# EAGLE design mano_rev_1_1 (EAGLE 9.2.2)
DATE: 2019.05.04; REV: 1.1
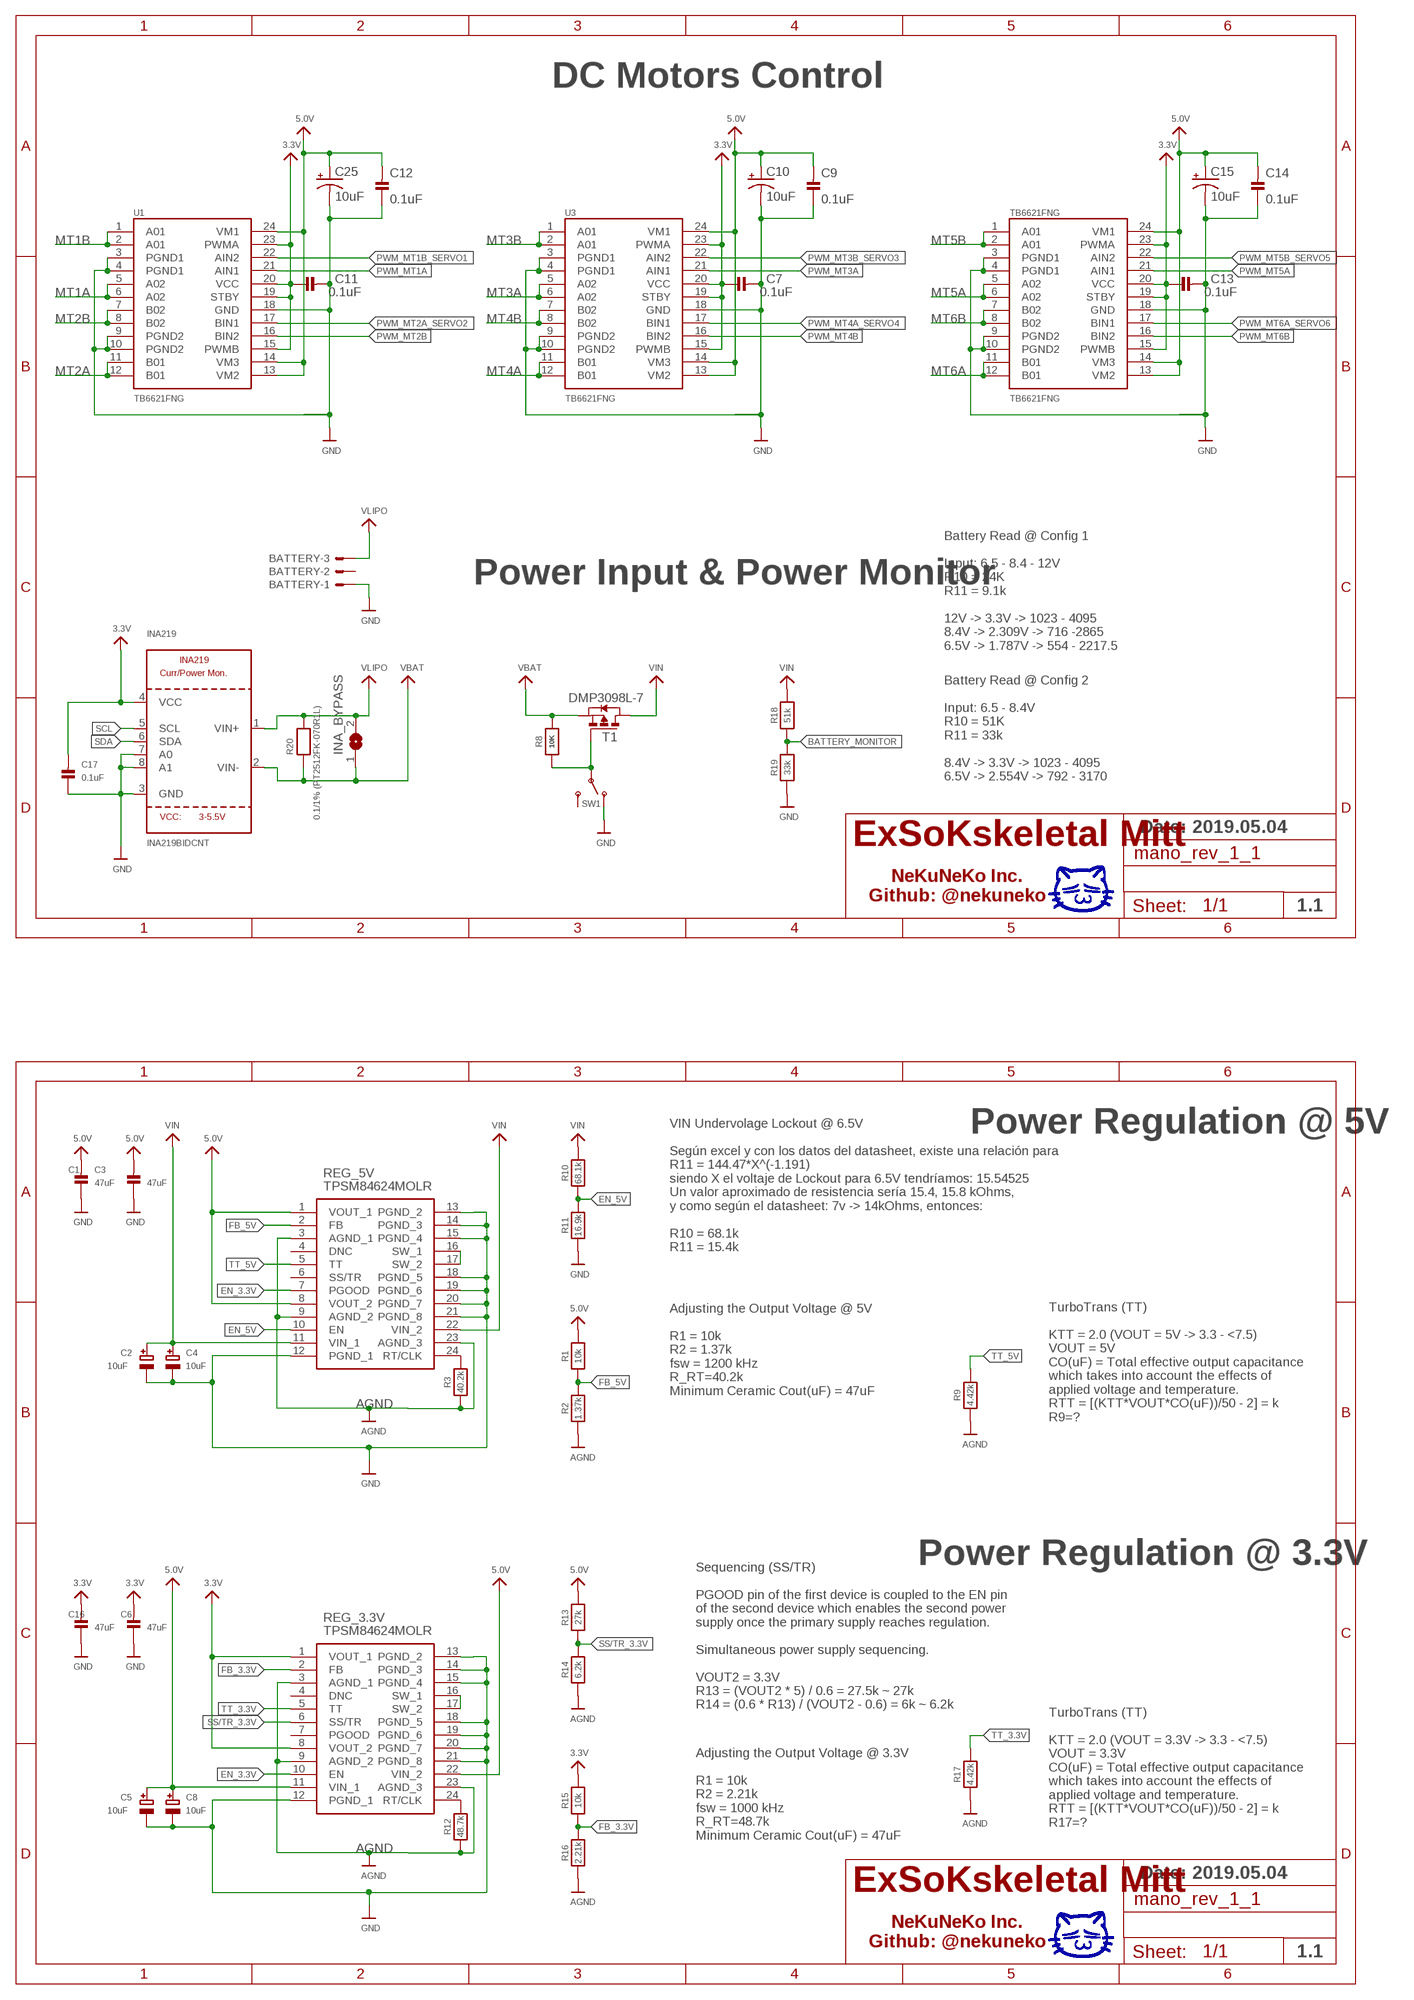
[diagram p0: schematic, sheet 1, part 1 of 2]
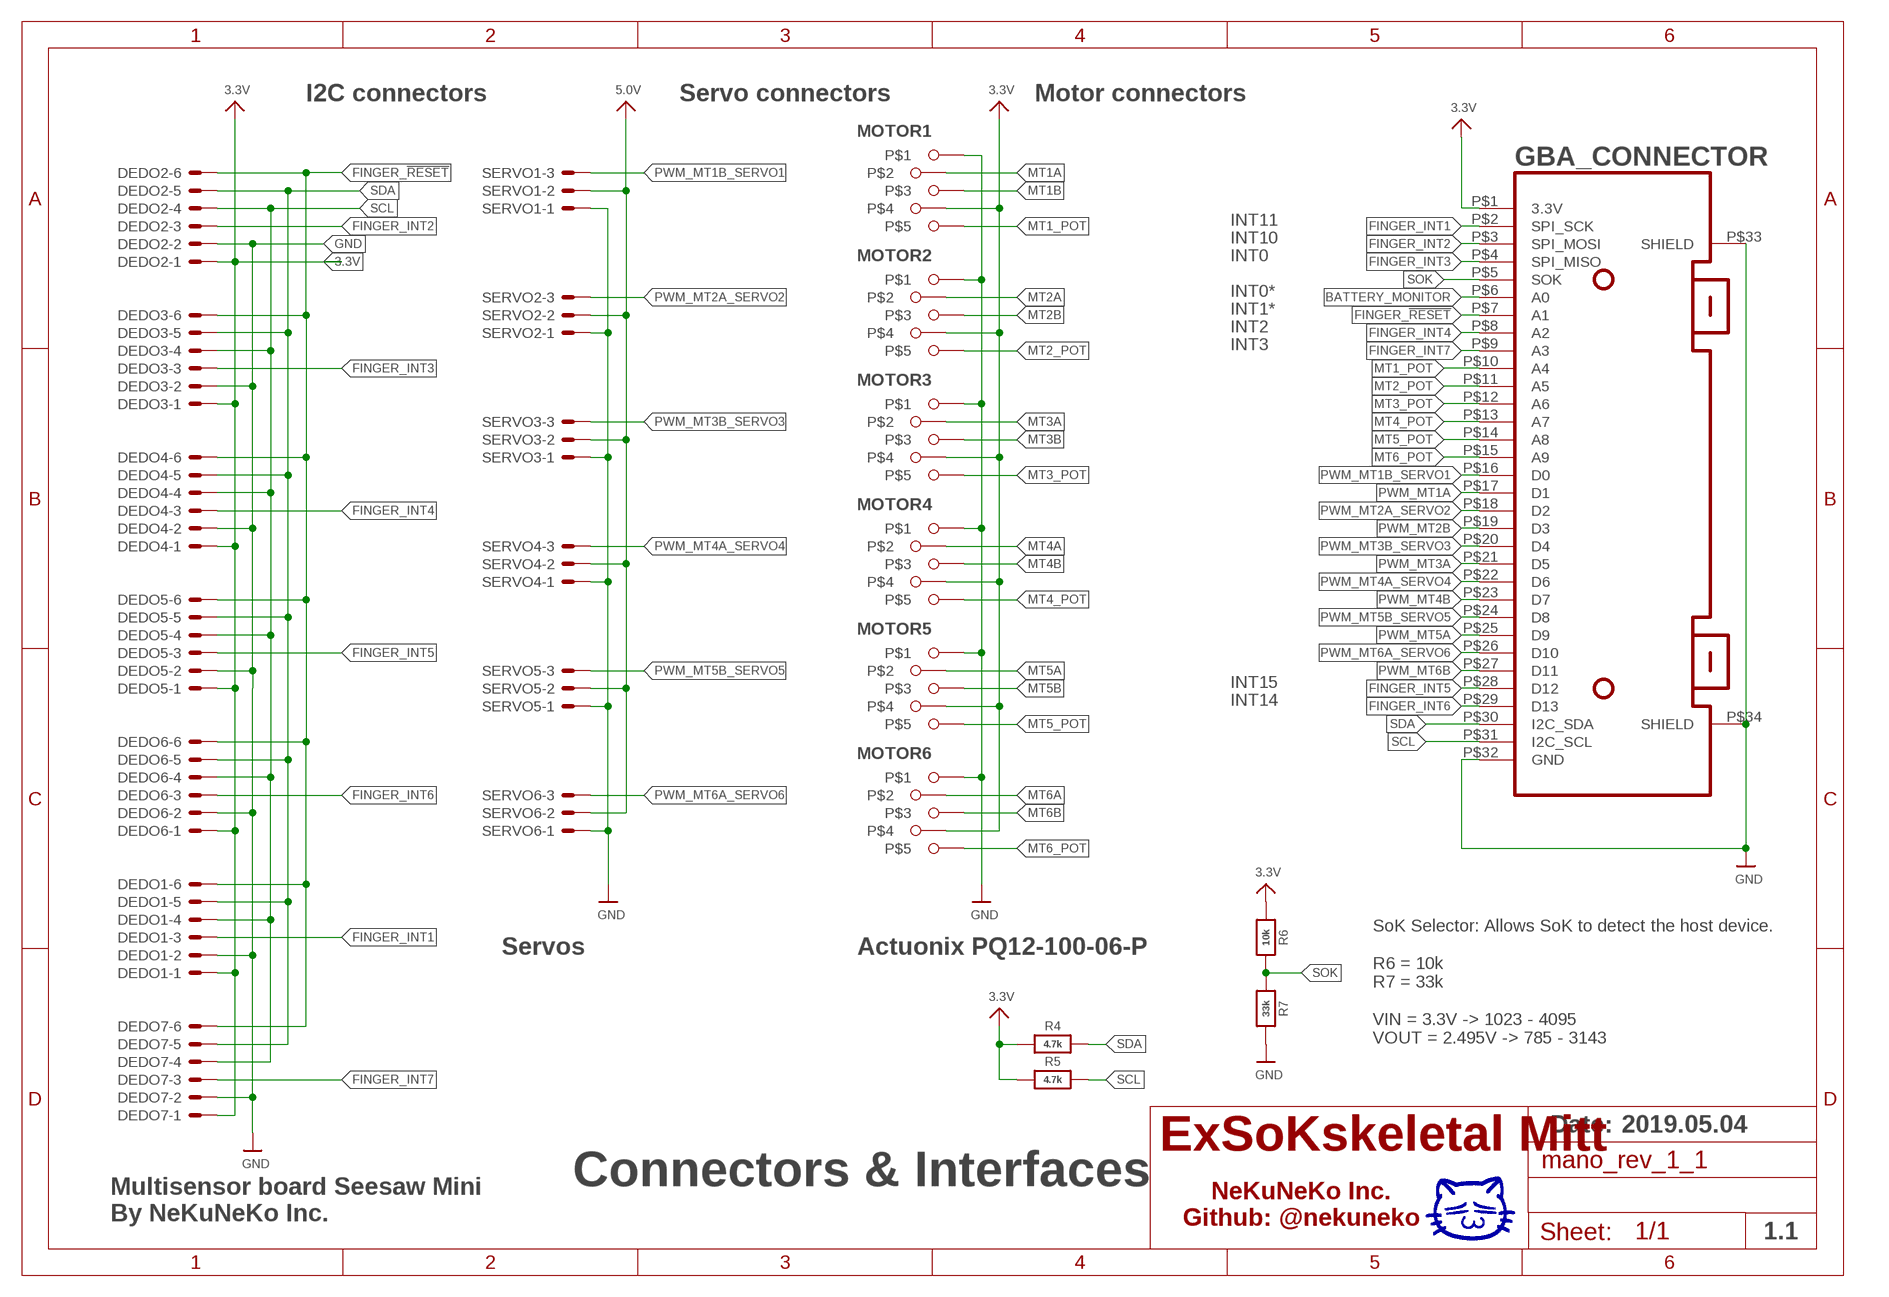
[diagram p1: schematic, sheet 1, part 2 of 2]

## Parts
BATTERY  JST-XH-03-PIN-LONG-PAD  [JST-XH-03-PACKAGE-LONG-PAD]
C1  47uF  CAP_CERAMIC_0603  [_0603]
C2  10uF  CAP_TANTALUMA/3216_REFLOW  [EIA3216-18/A-R]
C3  47uF  CAP_CERAMIC_0603  [_0603]
C4  10uF  CAP_TANTALUMA/3216_REFLOW  [EIA3216-18/A-R]
C5  10uF  CAP_TANTALUMA/3216_REFLOW  [EIA3216-18/A-R]
C6  47uF  CAP_CERAMIC_0603  [_0603]
C7  0.1uF  CAP_CERAMIC_0603  [_0603]
C8  10uF  CAP_TANTALUMA/3216_REFLOW  [EIA3216-18/A-R]
C9  0.1uF  CAP_CERAMIC_0603  [_0603]
C10  10uF  10UF-POLAR-0603-6.3V-20%(TANT)  [0603-POLAR]
C11  0.1uF  CAP_CERAMIC_0603  [_0603]
C12  0.1uF  CAP_CERAMIC_0603  [_0603]
C13  0.1uF  CAP_CERAMIC_0603  [_0603]
C14  0.1uF  CAP_CERAMIC_0603  [_0603]
C15  10uF  10UF-POLAR-0603-6.3V-20%(TANT)  [0603-POLAR]
C16  47uF  CAP_CERAMIC_0603  [_0603]
C17  0.1uF  CAP_CERAMIC_0603  [_0603]
C25  10uF  10UF-POLAR-0603-6.3V-20%(TANT)  [0603-POLAR]
DEDO1  FINGER_1  BM06B-SRSS-TB  [BM06B-SRSS-TB]
DEDO2  FINGER_2  BM06B-SRSS-TB  [BM06B-SRSS-TB]
DEDO3  FINGER_3  BM06B-SRSS-TB  [BM06B-SRSS-TB]
DEDO4  FINGER_4  BM06B-SRSS-TB  [BM06B-SRSS-TB]
DEDO5  FINGER_5  BM06B-SRSS-TB  [BM06B-SRSS-TB]
DEDO6  FINGER_6  BM06B-SRSS-TB  [BM06B-SRSS-TB]
DEDO7  FINGER_7  BM06B-SRSS-TB  [BM06B-SRSS-TB]
GBA_CONNECTOR  GBA_CARTRIDGE  [GBA_CARTRIDGE]
INA219  INA219BIDCNT  INA219  [SOT23-8]
INA_BYPASS  SOLDERJUMPERREFLOW_NOPASTE  [SOLDERJUMPER_REFLOW_NOPASTE]
MOTOR1  Actuonix PQ12-100-06-P  5PIN  [5PIN]
MOTOR2  Actuonix PQ12-100-06-P  5PIN  [5PIN]
MOTOR3  Actuonix PQ12-100-06-P  5PIN  [5PIN]
MOTOR4  Actuonix PQ12-100-06-P  5PIN  [5PIN]
MOTOR5  Actuonix PQ12-100-06-P  5PIN  [5PIN]
MOTOR6  Actuonix PQ12-100-06-P  5PIN  [5PIN]
R1  10k  RESISTOR_0603  [_0603]
R2  1.37k  RESISTOR_0603  [_0603]
R3  40.2k  RESISTOR_0603  [_0603]
R4  4.7k  RESISTOR_0603  [_0603]
R5  4.7k  RESISTOR_0603  [_0603]
R6  10k  RESISTOR_0603  [_0603]
R7  33k  RESISTOR_0603  [_0603]
R8  10K  RESISTOR_0805  [_0805]
R9  4.42k  RESISTOR_0603  [_0603]
R10  68.1k  RESISTOR_0603  [_0603]
R11  16.9k  RESISTOR_0603  [_0603]
R12  48.7k  RESISTOR_0603  [_0603]
R13  27k  RESISTOR_0603  [_0603]
R14  6.2k  RESISTOR_0603  [_0603]
R15  10k  RESISTOR_0603  [_0603]
R16  2.21k  RESISTOR_0603  [_0603]
R17  4.42k  RESISTOR_0603  [_0603]
R18  51k  RESISTOR_0603  [_0603]
R19  33k  RESISTOR_0603  [_0603]
R20  0.1/1% (PT2512FK-070R1L)  RESISTOR2512  [2512]
REG_3.3V  TPSM84624MOLR  [TPSM84624MOLR]
REG_5V  TPSM84624MOLR  [TPSM84624MOLR]
SERVO1  JST-XH-03-PIN-LONG-PAD  [JST-XH-03-PACKAGE-LONG-PAD]
SERVO2  JST-XH-03-PIN-LONG-PAD  [JST-XH-03-PACKAGE-LONG-PAD]
SERVO3  JST-XH-03-PIN-LONG-PAD  [JST-XH-03-PACKAGE-LONG-PAD]
SERVO4  JST-XH-03-PIN-LONG-PAD  [JST-XH-03-PACKAGE-LONG-PAD]
SERVO5  JST-XH-03-PIN-LONG-PAD  [JST-XH-03-PACKAGE-LONG-PAD]
SERVO6  JST-XH-03-PIN-LONG-PAD  [JST-XH-03-PACKAGE-LONG-PAD]
SW1  SWITCH_SPDT  [SPDT_SMT_SSSS811101]
T1  DMP3098L-7  PMOSSOT23  [SOT-23]
TB6621FNG  TB6621FNG  [SSOP24]
U1  TB6621FNG  [SSOP24]
U3  TB6621FNG  [SSOP24]

## Nets
3.3V: C6.2 C7.1 C11.1 C13.1 C16.2 C17.2 DEDO1.1 DEDO2.1 DEDO3.1 DEDO4.1 DEDO5.1 DEDO6.1 DEDO7.1 GBA_CONNECTOR.P$1(3.3V) INA219.4(VCC) MOTOR1.4 MOTOR2.4 MOTOR3.4 MOTOR4.4 MOTOR5.4 MOTOR6.4 R4.1 R5.1 R6.1 R15.2 REG_3.3V.1(VOUT_1) REG_3.3V.8(VOUT_2) TB6621FNG.15(PWMB) TB6621FNG.19(STBY) TB6621FNG.20(VCC) TB6621FNG.23(PWMA) U1.15(PWMB) U1.19(STBY) U1.20(VCC) U1.23(PWMA) U3.15(PWMB) U3.19(STBY) U3.20(VCC) U3.23(PWMA)
5.0V: C1.2 C3.2 C5.+ C8.+ C9.2 C10.+ C12.2 C14.2 C15.+ C25.+ R1.2 R13.2 REG_3.3V.11(VIN_1) REG_3.3V.22(VIN_2) REG_5V.1(VOUT_1) REG_5V.8(VOUT_2) SERVO1.2 SERVO2.2 SERVO3.2 SERVO4.2 SERVO5.2 SERVO6.2 TB6621FNG.13(VM2) TB6621FNG.14(VM3) TB6621FNG.24(VM1) U1.13(VM2) U1.14(VM3) U1.24(VM1) U3.13(VM2) U3.14(VM3) U3.24(VM1)
AGND: R2.1 R3.1 R9.1 R12.1 R14.1 R16.1 R17.1 REG_3.3V.3(AGND_1) REG_3.3V.9(AGND_2) REG_3.3V.23(AGND_3) REG_5V.3(AGND_1) REG_5V.9(AGND_2) REG_5V.23(AGND_3)
BATTERY_MONITOR: GBA_CONNECTOR.P$6(A0) R18.1 R19.2
EN_3.3V: REG_3.3V.10(EN) REG_5V.7(PGOOD)
EN_5V: R10.1 R11.2 REG_5V.10(EN)
FB_3.3V: R15.1 R16.2 REG_3.3V.2(FB)
FB_5V: R1.1 R2.2 REG_5V.2(FB)
FINGER_!RESET: DEDO1.6 DEDO2.6 DEDO3.6 DEDO4.6 DEDO5.6 DEDO6.6 DEDO7.6 GBA_CONNECTOR.P$7(A1)
FINGER_INT1: DEDO1.3 GBA_CONNECTOR.P$2(SPI_SCK)
FINGER_INT2: DEDO2.3 GBA_CONNECTOR.P$3(SPI_MOSI)
FINGER_INT3: DEDO3.3 GBA_CONNECTOR.P$4(SPI_MISO)
FINGER_INT4: DEDO4.3 GBA_CONNECTOR.P$8(A2)
FINGER_INT5: DEDO5.3 GBA_CONNECTOR.P$28(D12)
FINGER_INT6: DEDO6.3 GBA_CONNECTOR.P$29(D13)
FINGER_INT7: DEDO7.3 GBA_CONNECTOR.P$9(A3)
GND [gnd]: BATTERY.1 C1.1 C2.- C3.1 C4.- C5.- C6.1 C7.2 C8.- C9.1 C10.- C11.2 C12.1 C13.2 C14.1 C15.- C16.1 C17.1 C25.- DEDO1.2 DEDO2.2 DEDO3.2 DEDO4.2 DEDO5.2 DEDO6.2 DEDO7.2 GBA_CONNECTOR.P$32(GND) GBA_CONNECTOR.P$33(SHIELD) GBA_CONNECTOR.P$34(SHIELD) INA219.3(GND) INA219.7(A0) INA219.8(A1) MOTOR1.1 MOTOR2.1 MOTOR3.1 MOTOR4.1 MOTOR5.1 MOTOR6.1 R7.2 R11.1 R19.1 REG_3.3V.12(PGND_1) REG_3.3V.13(PGND_2) REG_3.3V.14(PGND_3) REG_3.3V.15(PGND_4) REG_3.3V.18(PGND_5) REG_3.3V.19(PGND_6) REG_3.3V.20(PGND_7) REG_3.3V.21(PGND_8) REG_5V.12(PGND_1) REG_5V.13(PGND_2) REG_5V.14(PGND_3) REG_5V.15(PGND_4) REG_5V.18(PGND_5) REG_5V.19(PGND_6) REG_5V.20(PGND_7) REG_5V.21(PGND_8) SERVO1.1 SERVO2.1 SERVO3.1 SERVO4.1 SERVO5.1 SERVO6.1 SW1.A(O) TB6621FNG.3(PGND1) TB6621FNG.4(PGND1) TB6621FNG.9(PGND2) TB6621FNG.10(PGND2) TB6621FNG.18(GND) U1.3(PGND1) U1.4(PGND1) U1.9(PGND2) U1.10(PGND2) U1.18(GND) U3.3(PGND1) U3.4(PGND1) U3.9(PGND2) U3.10(PGND2) U3.18(GND)
MT1_POT: GBA_CONNECTOR.P$10(A4) MOTOR1.5
MT1A: MOTOR1.2 U1.5(A02) U1.6(A02)
MT1B: MOTOR1.3 U1.1(A01) U1.2(A01)
MT2_POT: GBA_CONNECTOR.P$11(A5) MOTOR2.5
MT2A: MOTOR2.2 U1.11(B01) U1.12(B01)
MT2B: MOTOR2.3 U1.7(B02) U1.8(B02)
MT3_POT: GBA_CONNECTOR.P$12(A6) MOTOR3.5
MT3A: MOTOR3.2 U3.5(A02) U3.6(A02)
MT3B: MOTOR3.3 U3.1(A01) U3.2(A01)
MT4_POT: GBA_CONNECTOR.P$13(A7) MOTOR4.5
MT4A: MOTOR4.2 U3.11(B01) U3.12(B01)
MT4B: MOTOR4.3 U3.7(B02) U3.8(B02)
MT5_POT: GBA_CONNECTOR.P$14(A8) MOTOR5.5
MT5A: MOTOR5.2 TB6621FNG.5(A02) TB6621FNG.6(A02)
MT5B: MOTOR5.3 TB6621FNG.1(A01) TB6621FNG.2(A01)
MT6_POT: GBA_CONNECTOR.P$15(A9) MOTOR6.5
MT6A: MOTOR6.2 TB6621FNG.11(B01) TB6621FNG.12(B01)
MT6B: MOTOR6.3 TB6621FNG.7(B02) TB6621FNG.8(B02)
N$1: R8.1 SW1.B(P) T1.3(G)
N$2: REG_5V.16(SW_1) REG_5V.17(SW_2)
N$3: R12.2 REG_3.3V.24(RT/CLK)
N$4: REG_3.3V.16(SW_1) REG_3.3V.17(SW_2)
N$6: R3.2 REG_5V.24(RT/CLK)
PWM_MT1A: GBA_CONNECTOR.P$17(D1) U1.21(AIN1)
PWM_MT1B_SERVO1: GBA_CONNECTOR.P$16(D0) SERVO1.3 U1.22(AIN2)
PWM_MT2A_SERVO2: GBA_CONNECTOR.P$18(D2) SERVO2.3 U1.17(BIN1)
PWM_MT2B: GBA_CONNECTOR.P$19(D3) U1.16(BIN2)
PWM_MT3A: GBA_CONNECTOR.P$21(D5) U3.21(AIN1)
PWM_MT3B_SERVO3: GBA_CONNECTOR.P$20(D4) SERVO3.3 U3.22(AIN2)
PWM_MT4A_SERVO4: GBA_CONNECTOR.P$22(D6) SERVO4.3 U3.17(BIN1)
PWM_MT4B: GBA_CONNECTOR.P$23(D7) U3.16(BIN2)
PWM_MT5A: GBA_CONNECTOR.P$25(D9) TB6621FNG.21(AIN1)
PWM_MT5B_SERVO5: GBA_CONNECTOR.P$24(D8) SERVO5.3 TB6621FNG.22(AIN2)
PWM_MT6A_SERVO6: GBA_CONNECTOR.P$26(D10) SERVO6.3 TB6621FNG.17(BIN1)
PWM_MT6B: GBA_CONNECTOR.P$27(D11) TB6621FNG.16(BIN2)
SCL: DEDO1.4 DEDO2.4 DEDO3.4 DEDO4.4 DEDO5.4 DEDO6.4 DEDO7.4 GBA_CONNECTOR.P$31(I2C_SCL) INA219.5(SCL) R5.2
SDA: DEDO1.5 DEDO2.5 DEDO3.5 DEDO4.5 DEDO5.5 DEDO6.5 DEDO7.5 GBA_CONNECTOR.P$30(I2C_SDA) INA219.6(SDA) R4.2
SOK: GBA_CONNECTOR.P$5(SOK) R6.2 R7.1
SS/TR_3.3V: R13.1 R14.2 REG_3.3V.6(SS/TR)
TT_3.3V: R17.2 REG_3.3V.5(TT)
TT_5V: R9.2 REG_5V.5(TT)
VBAT: INA219.2(VIN-) INA_BYPASS.1 R8.2 R20.1 T1.2(S)
VIN: C2.+ C4.+ R10.2 R18.2 REG_5V.11(VIN_1) REG_5V.22(VIN_2) T1.1(D)
VLIPO: BATTERY.3 INA219.1(VIN+) INA_BYPASS.2 R20.2
Unconnected: BATTERY.2 REG_3.3V.4(DNC) REG_3.3V.7(PGOOD) REG_5V.4(DNC) REG_5V.6(SS/TR) SW1.C(S)

## Notes on the sheet
- I2C connectors | Servo connectors | Motor connectors
- DC Motors Control
- INT11
- INT10
- INT0
- INT0*
- INT1*
- INT2
- INT3
- INT15
- INT14
- Power Input & Power Monitor
- Battery Read @ Config 1
  
  Input: 6.5 - 8.4 - 12V
  R10 = 24K
  R11 = 9.1k
  
  12V -> 3.3V -> 1023 - 4095
  8.4V -> 2.309V -> 716 -2865
  6.5V -> 1.787V -> 554 - 2217.5
- Servos | Actuonix PQ12-100-06-P
- SoK Selector: Allows SoK to detect the host device.
  
  R6 = 10k
  R7 = 33k 
  
  VIN = 3.3V -> 1023 - 4095
  VOUT = 2.495V -> 785 - 3143
- Battery Read @ Config 2
  
  Input: 6.5 - 8.4V
  R10 = 51K
  R11 = 33k
  
  8.4V -> 3.3V -> 1023 - 4095
  6.5V -> 2.554V -> 792 - 3170
- Date: | Date:
- ExSoKskeletal Mitt | ExSoKskeletal Mitt
- Connectors & Interfaces
- NeKuNeKo Inc.
  Github: @nekuneko
- NeKuNeKo Inc.
  Github: @nekuneko
- Multisensor board Seesaw Mini
  By NeKuNeKo Inc.
- Power Regulation @ 5V
- VIN Undervolage Lockout @ 6.5V
  
  Según excel y con los datos del datasheet, existe una relación para 
  R11 = 144.47*X^(-1.191)
  siendo X el voltaje de Lockout para 6.5V tendríamos: 15.54525
  Un valor aproximado de resistencia sería 15.4, 15.8 kOhms, 
  y como según el datasheet: 7v -> 14kOhms, entonces:
  
  R10 = 68.1k
  R11 = 15.4k
- Adjusting the Output Voltage @ 5V
  
  R1 = 10k
  R2 = 1.37k
  fsw = 1200 kHz
  R_RT=40.2k
  Minimum Ceramic Cout(uF) = 47uF
- TurboTrans (TT)
  
  KTT = 2.0 (VOUT = 5V -> 3.3 - <7.5)
  VOUT = 5V
  CO(uF) = Total effective output capacitance
  which takes into account the effects of
  applied voltage and temperature.
  RTT = [(KTT*VOUT*CO(uF))/50 - 2] = k
  R9=?
- Power Regulation @ 3.3V
- Sequencing (SS/TR)
  
  PGOOD pin of the first device is coupled to the EN pin 
  of the second device which enables the second power 
  supply once the primary supply reaches regulation.
  
  Simultaneous power supply sequencing.
  
  VOUT2 = 3.3V
  R13 = (VOUT2 * 5) / 0.6 = 27.5k ~ 27k
  R14 = (0.6 * R13) / (VOUT2 - 0.6) = 6k ~ 6.2k
- TurboTrans (TT)
  
  KTT = 2.0 (VOUT = 3.3V -> 3.3 - <7.5)
  VOUT = 3.3V
  CO(uF) = Total effective output capacitance
  which takes into account the effects of
  applied voltage and temperature.
  RTT = [(KTT*VOUT*CO(uF))/50 - 2] = k
  R17=?
- Adjusting the Output Voltage @ 3.3V
  
  R1 = 10k
  R2 = 2.21k
  fsw = 1000 kHz
  R_RT=48.7k
  Minimum Ceramic Cout(uF) = 47uF
- Date:
- ExSoKskeletal Mitt
- NeKuNeKo Inc.
  Github: @nekuneko

## Library data of the parts
BATTERY SERVO1-SERVO6 = JST XH Connectors v1-0:JST-XH-03-PIN: JST XH Connector 2 Pin Wire to board connector. Pitch: 2,54 mm, (0.100") Number of pins: 3 Created by Rembrandt Electronics www.rembrandtelectronics.com
C1 C3 C6 C7 C9 C11-C14 C16 C17 = microbuilder:CAP_CERAMIC: Ceramic Capacitors 0402 - 0402 Surface Mount Capacitors 16pF 50V 5% [Digikey: 445-4899-2-ND] 18pF 50V 5% [Digikey: 490-1281-2-ND] 22pF 50V 5% [Digikey: 490-1283-2-ND] 68pF 50V 5% [Digikey: 490-1289-2-ND] 0.1uF 10V 10% [Digikey: 490-1318-2-ND] 1.0uF 6.3V 10% [Digikey: 490-1320-2-ND] 0603 - 0603 Surface Mount Capacitors 16 pF 50V 5% [Digikey: 445-5051-2-ND] 22 pF 50V [Digikey: PCC220ACVTR-ND] 33 pF 50V 5% [Digikey: 490-1415-1-ND] 56pF 50V 5% [Digikey: 490-1421-1-ND] 220pF 50V 5% [Digikey: 445-1285-1-ND] 680 pF 50V 2200 pF 50V 5% C0G [Digikey: 445-1297-1-ND] 5600 pF 100V 5% X7R [Digikey: 478-3711-1-ND] 0.1 µF 25V 10% [Digikey: PCC2277TR-ND] 0.22 µF 16V 10% X7R [Digikey: 445-1318-1-ND] 1.0 µF 25V 10% [Digikey: 445-5146-2-ND] 0603 - RF Specific 3pF 250V +/-0.1pF RF [Digikey: 712-1347-1-ND] 18 pF 250V 5% [Digikey: 478-3505-1-ND or 712-1322-1-ND] 56 pF 250V 5% C0G RF [Digikey: 490-4867-1-ND] 68 pF 250V RF [Digikey: 490-4868-1-ND] 0805 - 0805 Surface Mount Capacitors 220 pF 250V 2% RF Ceramic Capacitor [Digikey: 712-1398-1-ND] 1000 pF 50V 2% NP0 Ceramic Capacitor [Digikey: 478-3760-1-ND] 0.1 µF 25V 10% Ceramic Capacitor [Digikey: PCC1828TR-ND] 1.0 µF 16V 10% Ceramic Capacitor[Digikey: 490-1691-2-ND] 10.0 µF 10V 10% Ceramic Capacitor[Digikey: 709-1228-1-ND] 10.0 uF 16V 10% Ceramic Capacitor [Digikey: 478-5165-2-ND] 47 uF 6.3V 20% Ceramic Capacitor [Digikey: 587-1779-1-ND or 399-5506-1-ND] 1206 - 1206 Surface Mount Capacitors 47uF 10V 20% Ceramic Capacitor [Digikey: 490-5528-1-ND or 399-5508-1-ND or 445-6010-1-ND] 100uF 6.3V -20%, +80% Y5V Ceramic Capacitor (Digikey: 490-4512-1-ND, Mouser: 81-GRM31CF50J107ZE1L)
C2 C4 C5 C8 = microbuilder:CAP_TANTALUM: Tantalum Capacitors Wave footprints have larger pads and are meant to be used for hand soldering. Reflow footprints are optimised for solder paste and a reflow oven. EIA3216-18/A-[R/W] - Size A / 3216-18 / 1206 footprint 4.7µF 25V 10% Tantalum Capacitor 10µF 16V 10% Tantalum Capacitor [Digikey: 495-2236-2-ND] EIA3528-21/B-[R/W] - Size B / 3528-21 47µF 10V 10% Tantalum Capactior [Digikey: 495-2216-1-ND] EIA6032-28/C-[R/W] - Size C / 6032-28 10µF 35V 20% Tantalum Capacitor [Digikey: 495-2285-1-ND] 100µF 16V 10% Tantalum Capactior [Digikey: 399-5214-1-ND]
C10 C15 C25 = SparkFun-Capacitors:10UF-POLAR: 10.0µF polarized capacitors A capacitor is a passive two-terminal electrical component used to store electrical energy temporarily in an electric field.; MPN: F981A106MMA; PROD_ID: CAP-13210
DEDO1-DEDO7 = con-jst:?M06B-SRSS-TB: Disconnectable Crimp style connector, 1.0mm pitch 6 contacts
GBA_CONNECTOR = 0SoK:GBA_CARTRIDGE: GBA Cartridge Slot for NDS - from Aliexpress Gontak SoK main interface
INA219 = microbuilder:INA219: INA219 - I2C Current/Power Monitor Voltage Range: 0-26V Accuracy: 0.5% Temperature: -40°C - 125°C
INA_BYPASS = microbuilder:SOLDERJUMPER: SMD Solder JUMPER Solder the two pads together to create a connection, or remove the solder to break it. REFLOW - Use this footprint for solder paste and reflow ovens. WAVE - Use this footprint for hand-soldering (larger pads). CLOSED - Has a trace between the two pads to ensure it is closed by default. The trace needs to be cut to disable the jumper, and can be closed again by creating a solder bridge between the two pads.
MOTOR1-MOTOR6 = 0SoK:5PIN
R1-R20 = microbuilder:RESISTOR: Resistors 0402 - 0402 Surface Mount Package 22 Ohm 1% 1/16W [Digikey: 311-22.0LRTR-ND] 33 Ohm 5% 1/16W 1.0K 5% 1/16W 1.5K 5% 1/16W 2.0K 1% 1/16W 10.0K 1% 1/16W [Digikey: 311-10.0KLRTR-ND] 10.0K 5% 1/16W [Digikey: RMCF0402JT10K0TR-ND] 12.1K 1% 1/16W [Digikey: 311-22.0LRTR-ND] 100.0K 5% 1/16W 0603 - 0603 Surface Mount Package 0 Ohm 1/10 Watt 1% Resistor 15 Ohm 1/10 Watt 1% Resistor 33 Ohm 1/10 Watt 1% Resistor 49.9 Ohm 1/10 Watt 1% Resistor 100 Ohm 1/10 Watt 1% Resistor 150 Ohm 1/10 Watt 1% Resistor 240 Ohm 1/10 Watt 1% Resistor 390 Ohm 1/10 Watt 1% Resistor 560 Ohm 1/10 Watt 1% Resistor 680 Ohm 1/10 Watt 1% Resistor 750 Ohm 1/10 Watt 1% Resistor 1.0K Ohm 1/10 Watt 1% Resistor 1.5K Ohm 1/10 Watt 1% Resistor 2.0K Ohm 1/10 Watt 1% Resistor 2.2K Ohm 1/10 Watt 1% Resistor 3.3K Ohm 1/10 Watt 1% Resistor 4.7K Ohm 1/10 Watt 1% Resistor 10.0K Ohm 1/10 Watt 1% Resistor 12.0K Ohm 1/10 Watt 1% Resistor 12.1K Ohm 1/10 Watt 1% Resistor 20.0K Ohm 1/10 Watt 1% Resistor 33.0K Ohm 1/10 Watt 1% Resistor 100.0K Ohm 1/10 Watt 1% Resistor 0805 - 0805 Surface Mount Package 0 Ohm 1/8 Watt 1% Resistor 33 Ohm 1/8 Watt 1% Resistor 100 Ohm 1/8 Watt 1% Resistor 150 Ohm 1/8 Watt 1% Resistor 200 Ohm 1/8 Watt 1% Resistor 240 Ohm 1/8 Watt 1% Resistor 330 Ohm 1/8 Watt 1% Resistor 390 Ohm 1/8 Watt 1% Resistor 470 Ohm 1/8 Watt 1% Resistor 1.0K Ohm 1/8 Watt 1% Resistor 1.5K Ohm 1/8 Watt 1% Resistor 2.0K Ohm 1/8 Watt 1% Resistor 4.7K Ohm 1/8 Watt 1% Resistor 5.1K Ohm 1/8 Watt 1% Resistor 5.6K Ohm 1/8 Watt 1% Resistor 10.0K Ohm 1/8 Watt 1% Resistor 22.0K Ohm 1/8 Watt 1% Resistor 33.0K Ohm 1/8 Watt 1% Resistor 100K Ohm 1/8 Watt 1% Resistor 1206 - 1206 Surface Mount Package 2012 - 2010 Surface Mount Package 0.11 Ohm 1/2 Watt 1% Resistor - Digikey: RHM.11UCT-ND
REG_3.3V REG_5V = TPSM84624MOLR:TPSM84624MOLR: 4.5V to 17V Input, 0.6V-10V Output, 6A Power Module in Compact 7.5x7.5mm Footprint Source: Datasheet <http://www.ti.com/lit/gpn/tpsm84624>; DESCRIPTION: 4.5V to 17V Input, 0.6V-10V Output, 6A Power Module in Compact 7.5x7.5mm Footprint; HEIGHT: 5mm; MANUFACTURER_NAME: Texas Instruments; MANUFACTURER_PART_NUMBER: TPSM84624MOLR; MOUSER_PART_NUMBER: 595-TPSM84624MOLR
SW1 = microbuilder:SWITCH_SPDT: Switch - SPDT SSSS811101 - Horizontal Two Position SMT, 0.3A 4V [Mouser: 688-SSSS811101]
T1 = zetex:PMOSSOT23: MOS FET; OC_FARNELL: unknown; OC_NEWARK: unknown
TB6621FNG U1 U3 = SparkFun:TB6621FNG: Toshiba 1A motor driver

## Net classes
2 gnd: width 0.254 mm, drill 0.61 mm, clearance 0.254 mm

## Board
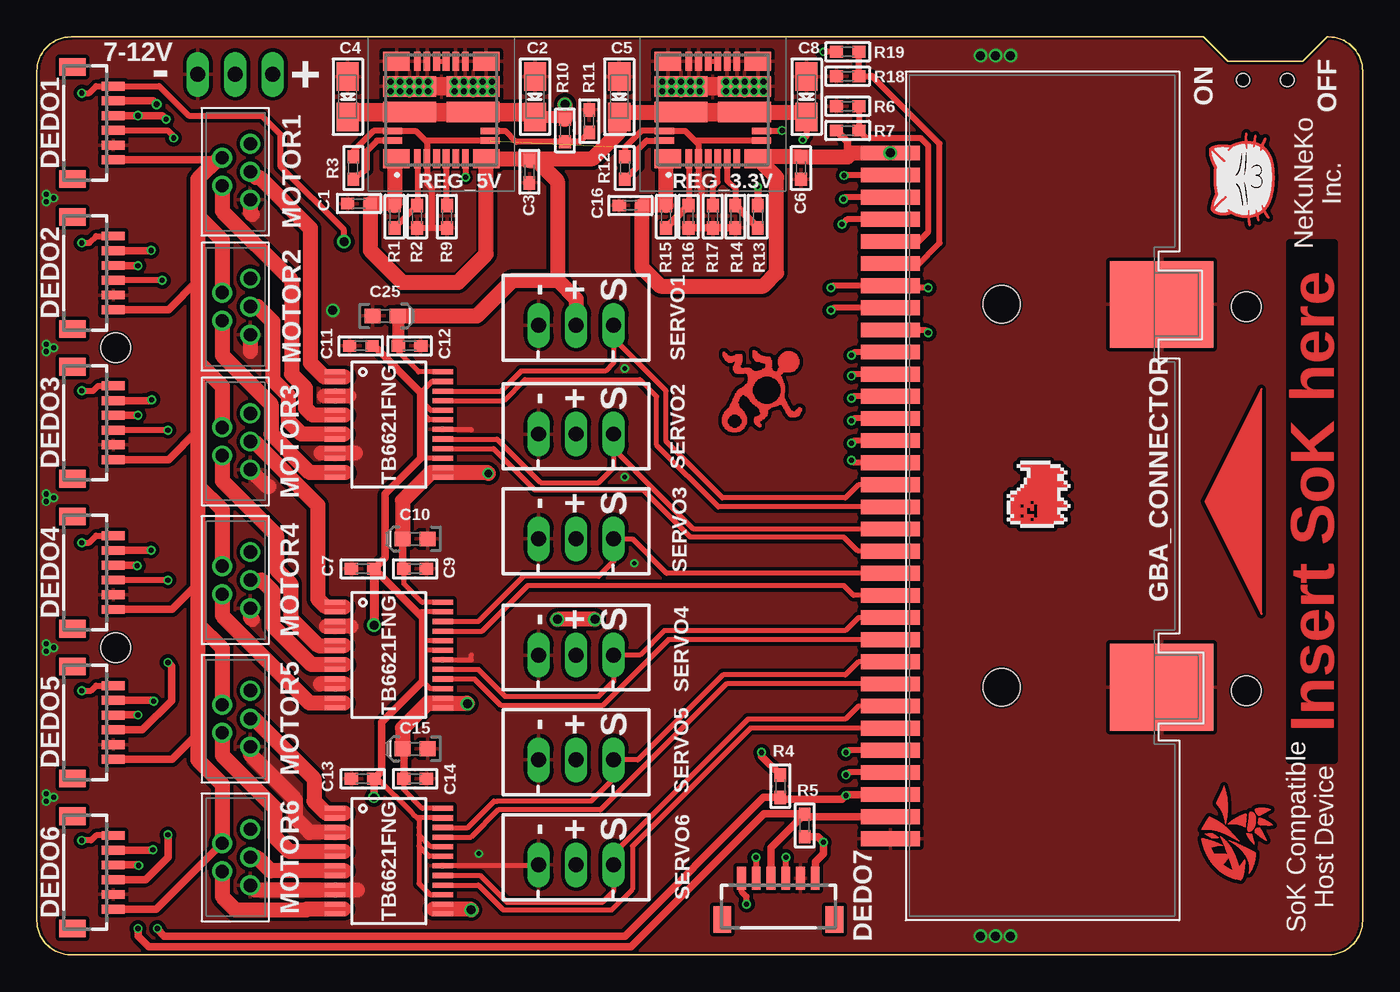
[diagram p2: board, top side]
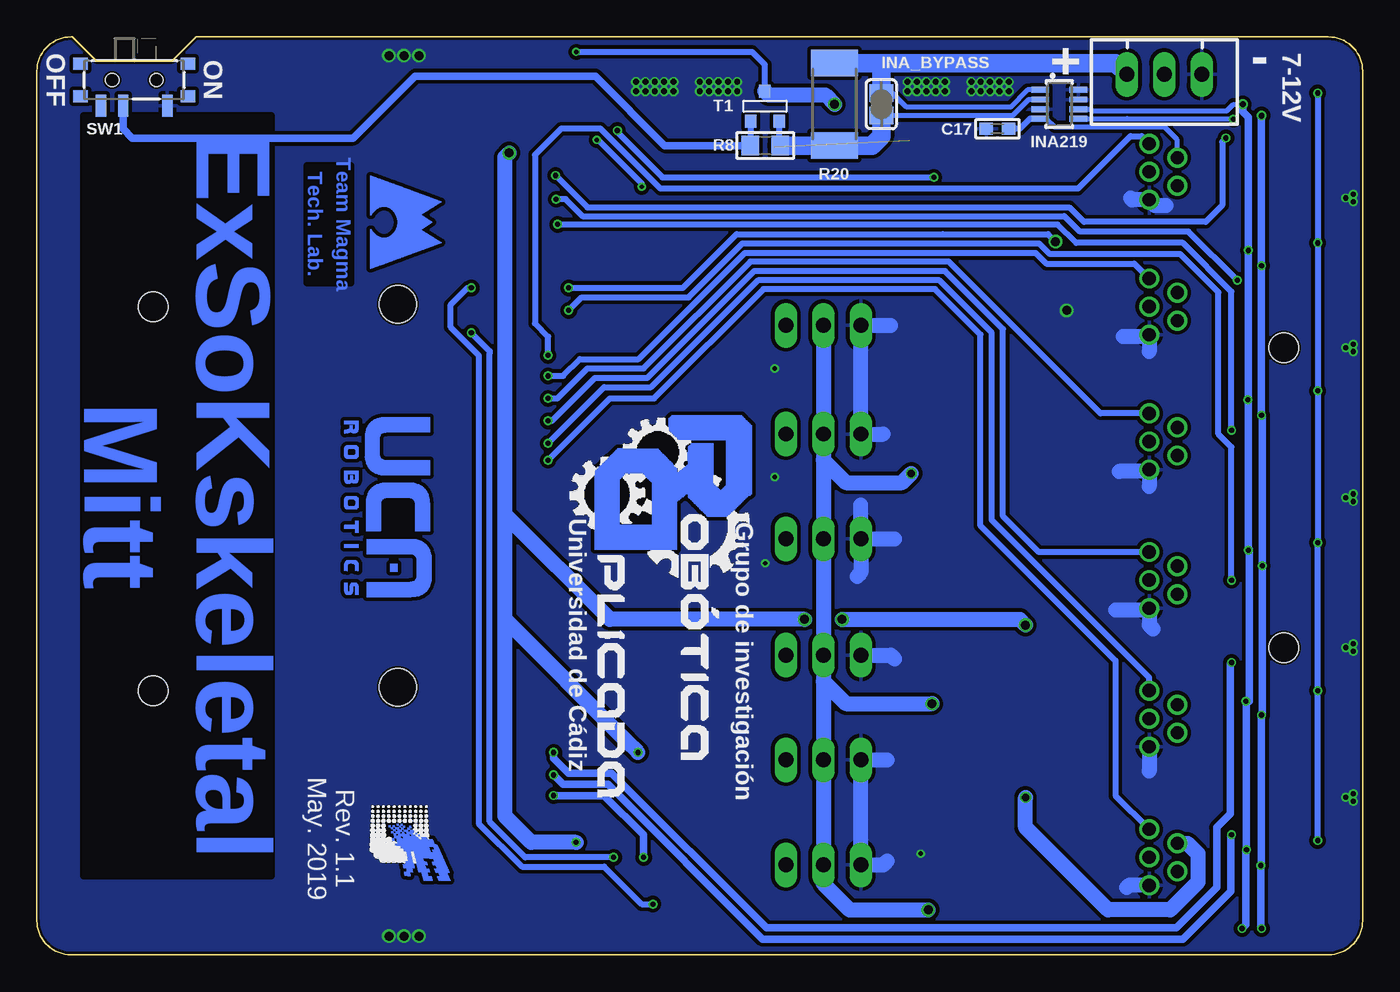
[diagram p3: board, bottom side, seen from below]

Size 89.92 x 62.23 mm. Coordinates in mm from the lower left corner, seen from the top.
Outline: 80.77,60.58 85.85,60.58 87.5,62.23 87.59,62.23 arc-90 89.92,59.91 89.92,2.32 arc-90 87.59,0 2.32,0 arc-90 0,2.32 0,59.91 arc-90 2.32,62.23 79.12,62.23 80.77,60.58
Copper layers (1*16): Top 0.035559375mm / dielectric 1.6mm / Bottom 0.035559375mm
Design rules "nekuneko *": minimum track width 6mil, minimum drill 6mil, track to track 6mil, track to pad 6mil, pad to pad 6mil, via to via 6mil, smd to smd 6mil, copper to edge 6mil, drill to drill 6mil, minimum pad ring 5mil, minimum via ring 5mil, stop-mask expansion 2.5mil, vias tented up to drill 0mil, thermal gap 10mil
Holes 2 mm at 82.04,43.94 82.04,17.91 5.33,20.83 5.33,41.15

### Footprints (pad centres in the part's own frame; a part is rotated, then mirrored left to right if it is on the bottom)
JST-XH-03-PACKAGE-LONG-PAD = drill 1.016 long: 1 -2.54,0; 2 0,0; 3 2.54,0
_0603 = smd 0.9 x 0.8: 1 -0.762,0; 2 0.762,0
EIA3216-18/A-R = smd 1.95 x 1.5: + 1.375,0; - -1.375,0
0603-POLAR = smd 1.1 x 1: + 0.85,0; - -0.85,0
BM06B-SRSS-TB = smd 0.6 x 1.55: 1 -2.5,-1.875; 2 -1.5,-1.875; 3 -0.5,-1.875; 4 0.5,-1.875; 5 1.5,-1.875; 6 2.5,-1.875 | smd 1.2 x 1.8: FIT@1 3.8,0.9; FIT@2 -3.8,0.9
GBA_CARTRIDGE = smd 1 x 4: P$1 5.25,-1.3; P$2 6.75,-1.3; P$3 8.25,-1.3; P$4 9.75,-1.3; P$5 11.25,-1.3; P$6 12.75,-1.3; P$7 14.25,-1.3; P$8 15.75,-1.3; P$9 17.25,-1.3; P$10 18.75,-1.3; P$11 20.25,-1.3; P$12 21.75,-1.3; P$13 23.25,-1.3; P$14 24.75,-1.3; P$15 26.25,-1.3; P$16 27.75,-1.3; P$17 29.25,-1.3; P$18 30.75,-1.3; P$19 32.25,-1.3; P$20 33.75,-1.3; P$21 35.25,-1.3; P$22 36.75,-1.3; P$23 38.25,-1.3; P$24 39.75,-1.3; P$25 41.25,-1.3; P$26 42.75,-1.3; P$27 44.25,-1.3; P$28 45.75,-1.3; P$29 47.25,-1.3; P$30 48.75,-1.3; P$31 50.25,-1.3; P$32 51.75,-1.3 | smd 5.88 x 7: P$33 15.525,17.1; P$34 41.475,17.1 | hole 2.54: 15.525,6.25; 41.475,6.25
SOT23-8 = smd 0.4 x 1.2: 1 -0.975,-1.3; 2 -0.325,-1.3; 3 0.325,-1.3; 4 0.975,-1.3; 5 0.975,1.3; 6 0.325,1.3; 7 -0.325,1.3; 8 -0.975,1.3
SOLDERJUMPER_REFLOW_NOPASTE = smd 1.168 x 1.6: 1 -0.762,0; 2 0.762,0
5PIN = drill 0.9: 1 -1.905,0; 2 -0.953,1.905; 3 0,0; 4 0.953,1.905; 5 1.905,0
_0805 = smd 1.2 x 1.3: 1 -1.016,0; 2 1.016,0
2512 = smd 1.8 x 3.2: 1 -2.8,0; 2 2.8,0
TPSM84624MOLR = smd 1.3 x 1.8: 1 -3.3,3.05; 8 -3.3,-3.05; 13 3.3,-3.05; 20 3.3,3.05 | smd 1.3 x 0.45: 2 -3.3,1.625; 3 -3.3,0.975; 4 -3.3,0.325; 5 -3.3,-0.325; 6 -3.3,-0.975; 7 -3.3,-1.625; 14 3.3,-1.625; 15 3.3,-0.975; 16 3.3,-0.325; 17 3.3,0.325; 18 3.3,0.975; 19 3.3,1.625 | smd 0.45 x 1.3: 9 -2.075,-3.3; 10 -1.425,-3.3; 23 -1.425,3.3; 24 -2.075,3.3 | smd 1.4 x 3.6: 11 -0.15,-2.15; 12 1.6,-2.15; 21 1.6,2.15; 22 -0.15,2.15
SPDT_SMT_SSSS811101 = smd 0.7 x 1.5: A -2.25,1.75; B 0.75,1.75; C 2.25,1.75 | smd 1 x 0.8: SUP1 -3.65,1.1; SUP2 -3.65,-1.1; SUP3 3.65,1.1; SUP4 3.65,-1.1 | hole 0.9: -1.5,0; 1.5,0
SOT-23 = smd 0.787 x 0.889: 1 0.025,-1.016; 2 -0.94,1.016; 3 0.991,1.016
SSOP24 = smd 0.348 x 1.397: 1 -3.575,-3.656; 2 -2.925,-3.656; 3 -2.275,-3.656; 4 -1.625,-3.656; 5 -0.975,-3.656; 6 -0.325,-3.656; 7 0.325,-3.656; 8 0.975,-3.656; 9 1.625,-3.656; 10 2.275,-3.656; 11 2.925,-3.656; 12 3.575,-3.656; 13 3.575,3.656; 14 2.925,3.656; 15 2.275,3.656; 16 1.625,3.656; 17 0.975,3.656; 18 0.325,3.656; 19 -0.325,3.656; 20 -0.975,3.656; 21 -1.625,3.656; 22 -2.275,3.656; 23 -2.925,3.656; 24 -3.575,3.656

### Placement (x,y rotation side)
BATTERY  13.46,59.69 180 bottom
C1  21.84,50.93 0 top
C2  33.78,58.17 270 top
C3  33.4,53.09 90 top
C4  21.08,58.17 270 top
C5  39.5,58.17 270 top
C6  51.82,53.34 90 top
C7  22.1,26.16 180 top
C8  52.2,58.17 270 top
C9  25.65,26.16 180 top
C10  25.65,28.19 180 top
C11  21.97,41.27 180 top
C12  25.27,41.27 180 top
C13  22.1,11.94 180 top
C14  25.65,11.94 180 top
C15  25.65,13.97 180 top
C16  40.26,50.8 0 top
C17  24.77,56.01 0 bottom
C25  23.62,43.31 0 top
DEDO1  3.3,56.39 90 top
DEDO2  3.3,46.23 90 top
DEDO3  3.3,36.07 90 top
DEDO4  3.3,25.91 90 top
DEDO5  3.3,15.75 90 top
DEDO6  3.3,5.59 90 top
DEDO7  50.29,3.3 180 top
GBA_CONNECTOR  59.18,59.62 270 top
INA219  20.57,57.66 270 bottom
INA_BYPASS  32.64,57.66 90 bottom
MOTOR1  14.48,53.09 90 top
MOTOR2  14.48,43.94 90 top
MOTOR3  14.48,34.8 90 top
MOTOR4  14.48,25.4 90 top
MOTOR5  14.48,16 90 top
MOTOR6  14.48,6.6 90 top
R1  24.26,50.04 90 top
R2  25.78,50.04 90 top
R3  21.46,53.34 270 top
R4  50.42,11.43 270 top
R5  52.07,8.76 90 top
R6  54.99,55.88 0 top
R7  54.99,57.53 180 top
R8  40.51,54.86 0 bottom
R9  27.81,50.04 90 top
R10  35.81,55.88 90 top
R11  37.47,56.52 270 top
R12  39.88,53.34 270 top
R13  48.9,50.04 90 top
R14  47.37,50.04 90 top
R15  42.67,50.04 90 top
R16  44.2,50.04 90 top
R17  45.85,50.04 90 top
R18  54.99,61.21 180 top
R19  54.99,59.56 0 top
R20  35.81,57.66 90 bottom
REG_3.3V  45.85,57.28 90 top
REG_5V  27.43,57.28 90 top
SERVO1  36.58,42.67 0 top
SERVO2  36.58,35.31 0 top
SERVO3  36.58,28.19 0 top
SERVO4  36.58,20.32 0 top
SERVO5  36.58,13.21 0 top
SERVO6  36.58,6.1 0 top
SW1  83.31,59.31 180 bottom
T1  40.51,57.53 180 bottom
TB6621FNG  23.88,6.35 270 top
U1  23.88,35.94 270 top
U3  23.88,20.32 270 top
U$6  [DOG2]  70.1,28.96 90 top
U$7  [SOK_FINISH]  84.07,4.95 90 top
U$8  [NEKO_TPLACE_6_5]  83.95,49.4 90 top
U$9  [MAGMA]  67.31,52.83 270 bottom
U$14  [UCAROBOTICS]  69.34,36.7 270 bottom
U$48  [GIRA_2_DRAWN_14]  54.36,36.7 270 bottom
U$50  [TRIANGLE]  79.25,30.73 0 top
U$51  [DIGIMON]  67.31,10.16 270 bottom
U$52  [BUGS_6]  52.07,35.18 90 top

### Tracks (layer width: path | path; a pad name or v marks a point on that pad's centre or on a via)
3.3V  (via drill 0.35, 0.5, 0.61)
  Top 0.35: U3.15 26.66,18.05 26.16,18.54 26.16,20.83 | 26.16,20.83 26.16,21.08 26.16,21.34 | 26.16,21.34 26.16,21.84 26.16,22.86 26.16,23.11 26.03,23.25 U3.23 | U3.20 26.2,21.3 26.16,21.34 | U3.19 26.34,20.64 26.16,20.83 | 27.43,38.87 U1.23 26.8,38.87 26.04,38.1 | C13.1 23.11,11.94 25.4,9.65 25.65,9.4 | 25.91,8.13 25.91,8.64 25.91,9.14 25.65,9.4 | 25.91,8.13 25.91,7.37 | 25.91,7.37 25.91,4.83 26.66,4.08 TB6621FNG.15 | TB6621FNG.19 26.6,6.67 25.91,7.37 | TB6621FNG.20 26.71,7.33 25.91,8.13 | TB6621FNG.23 25.78,9.28 25.65,9.4 | U1.20 26.71,36.92 26.04,37.59 | U1.19 26.6,36.27 26.04,36.83 | U1.15 26.05,33.67 26.04,33.66
  Top 0.508: MOTOR6.4 8.1,3.09 DEDO6.1 | DEDO3.1 8.93,33.57 10.92,35.56 | DEDO5.1 9.18,13.25 10.92,14.99 | DEDO4.1 9.18,23.41 10.92,25.15 | DEDO2.1 8.93,43.73 10.92,45.72 | DEDO1.1 12.42,53.89 MOTOR1.4 | MOTOR5.4 12.57,18.41 | 26.16,22.86 C7.1 23.62,26.92 23.62,31.24 26.04,33.66 26.04,36.83 26.04,37.59 26.04,38.1 22.86,41.27 C11.1 | 26.16,23.11 26.16,18.54 23.37,15.75 23.37,12.45 C13.1 v22.86,10.67 | v49.15,13.72 49.15,13.46 R4.1 | R5.1 52.96,8 v53.34,7.62 53.34,6.86 52.79,6.31 DEDO7.1 | 42.67,53.85 REG_3.3V.1 | R6.1 54.99,55.12 54.99,54.1
  Top 0.61: C7.1 v22.86,22.35
  Top 0.813: 49.4,53.85 49.03,53.85 REG_3.3V.8 | 51.9,54.19 C6.2
  Top 1.016: MOTOR1.4 12.38,54.04 10.92,52.58 10.92,50.1 | 10.92,50.1 10.92,49.59 10.92,45.72 10.92,45.21 10.92,40.2 | MOTOR2.4 12.57,48.45 10.92,50.1 | MOTOR3.4 12.57,38.54 10.92,40.2 | 10.92,31.81 10.92,35.56 10.92,40.2 | 10.92,31.81 10.92,30.8 10.92,25.15 10.92,22.42 | MOTOR4.4 12.57,30.16 10.92,31.81 | MOTOR5.4 12.57,20.77 10.92,22.42 | MOTOR6.4 12.57,11.56 10.92,13.21 10.92,14.99 10.92,22.42 | v37.85,22.73 v35.31,22.73 | 42.54,53.98 REG_3.3V.1 42.67,53.85 R15.2 C16.2 41.02,46.61 42.29,45.34 49.28,45.34 50.16,46.23 50.16,52.71 REG_3.3V.8 | REG_3.3V.8 49.02,54.1 | REG_3.3V.8 49.02,54.1 C6.2 54.99,54.1 55.25,54.37 GBA_CONNECTOR.P$1
  Bottom 0.35: MOTOR1.4 12.57,55.24 13.46,56.13 20.45,56.13 20.89,56.13 21.43,56.68 INA219.4 | 24.06,56.06 C17.2
  Bottom 0.406: INA219.4 22.57,56.68 23.24,56.01 C17.2
  Bottom 1.016: v53.34,7.62 56.39,7.62 58.17,9.4 58.17,22.73 | v22.86,22.35 23.24,22.73 v35.31,22.73 | v37.85,22.73 51.05,22.73 58.17,29.84 | MOTOR6.4 11.87,7.56 11.18,6.86 11.18,4.92 13.05,3.05 17.27,3.05 22.86,8.64 v22.86,10.67 | 58.17,22.73 58.17,29.84 | v49.15,13.72 49.91,14.48 58.17,22.73 | 58.17,29.84 58.17,54.08 GBA_CONNECTOR.P$1
  other vias: 57.88,54.37
5.0V  (via drill 0.3, 0.51, 0.61)
  Top 0.35: TB6621FNG.13 27.23,2.77 26.9,3.1 27.2,3.1 TB6621FNG.14 | U3.13 27.21,17.07 26.75,17.07 | 26.75,17.07 26.5,17.07 | U3.14 27.2,17.07 26.75,17.07 | TB6621FNG.24 26.14,9.93 24.89,11.18 C14.2 | U1.24 25.89,39.52 24.51,40.89 C12.2 | U3.24 26.14,23.89 24.89,25.15 C9.2 | U1.14 30.23,33.02 30.56,32.69 30.68,32.56 30.62,32.63 | v30.61,32.64 30.61,32.37 U1.13
  Top 0.406: C8.+ 52.2,55.5 v51.94,55.24
  Top 0.508: C14.2 24.89,13.88 C15.+ | C9.2 24.8,26.25 C10.+ | 24.26,53.85 REG_5V.1 | R13.2 v48.9,52.07
  Top 0.813: C25.+ 24.93,43.31 24.51,42.97 C12.2
  Top 1.016: v29.46,3.05 29.41,3.1 26.9,3.1 | v29.21,17.02 29.16,17.07 26.75,17.07 | 26.5,17.07 24.8,15.37 C15.+ | C10.+ 24.8,30.78 26.71,32.69 30.56,32.69 | v30.61,32.64 30.62,32.63 | C25.+ 29.84,43.31 32.26,45.72 33.91,45.72 35.31,45.72 | C5.+ 39.5,55.77 37.7,53.98 33.53,53.98 C3.2 | 39.54,57.13 REG_3.3V.22 | 35.31,45.72 36.58,44.45 SERVO1.2 | REG_5V.8 | REG_5V.1 24.26,53.85 R1.2 24.13,50.93 C1.2 22.61,47.75 24.77,45.59 28.57,45.59 30.48,47.5 REG_5V.8 | REG_5V.8 | REG_5V.8 33.27,53.98 C3.2 | REG_3.3V.11 51.86,57.13 C8.+ | C3.2 33.91,53.85 35.31,52.45 35.31,45.72
  Top 1.27: 43.67,57.15 REG_3.3V.22 REG_3.3V.11 48.04,57.17 | C5.+ 39.54,57.13
  Bottom 0.406: v48.9,52.07 48.9,52.3 51.89,55.29 v51.94,55.24
  Bottom 1.016: SERVO4.2 SERVO5.2 SERVO6.2 36.58,4.83 34.8,3.05 v29.46,3.05 | SERVO4.2 SERVO3.2 36.58,33.53 | 36.58,33.53 36.58,34.29 36.58,34.54 36.58,35.05 SERVO2.2 SERVO1.2 | SERVO4.2 36.58,18.54 35.05,17.02 v29.21,17.02 | 36.58,33.53 35.05,32 31.24,32 v30.61,32.64
AGND  (1 unrouted)
  Top 0.406: 25.68,55.85 REG_5V.23 22.83,55.85 21.46,54.48 R3.1 | 25.68,55.85 26.46,55.08 REG_5V.3 26.46,52.28 26.8,51.94 26.8,49.28 | REG_5V.9 26.33,55.2 25.68,55.85 | 43.97,55.85 REG_3.3V.23 40.99,55.85 39.88,54.74 R12.1 | 43.97,55.85 44.87,54.95 REG_3.3V.3 44.87,52.16 45.09,51.94 45.09,49.28 | REG_3.3V.9 44.62,55.2 43.97,55.85 | R2.1 26.8,49.28 | 26.8,49.28 R9.1
  Top 0.508: R14.1 R17.1 45.09,49.28 R16.1
  pour Top (isolate 0.012): 23.5,52.83 23.5,47.75 25.02,46.23 28.32,46.23 29.84,47.75 29.84,53.09 23.75,53.09
  pour Top (isolate 0.012): 41.66,53.09 41.66,46.86 42.55,45.97 49.02,45.97 49.53,46.48 49.53,52.58 49.02,53.09
BATTERY_MONITOR
  Top 0.406: GBA_CONNECTOR.P$6 59.64,46.69 61.21,48.26 61.21,54.99 56.64,59.56 R19.2 R18.1
EN_3.3V  (via drill 0.35)
  Top 0.406: REG_5V.7 29.08,53.95 v29.08,52.7 | REG_3.3V.10 50.52,55.85 v50.55,55.88
  Bottom 0.406: v29.08,52.7 47.5,52.7 50.55,55.75 v50.55,55.88
EN_5V
  Top 0.406: REG_5V.10 31.78,55.85 32.51,55.12 R10.1 36.83,55.12 R11.2
FB_3.3V
  Top 0.406: REG_3.3V.2 44.22,50.83 R16.2
  Top 0.508: R15.1 R16.2
FB_5V
  Top 0.406: REG_5V.2 25.81,50.83 R2.2 R1.1
FINGER_!RESET  (via drill 0.35, 0.61)
  Top 0.406: DEDO6.6 4.02,8.09 3.68,7.75 v3.05,7.75 | v3.05,17.91 3.68,17.91 4.02,18.25 DEDO5.6 | v3.05,27.94 3.56,27.94 4.02,28.41 DEDO4.6 | v3.05,38.23 3.81,38.23 4.15,38.57 DEDO3.6 | v3.05,48.26 3.56,48.26 4.02,48.73 DEDO2.6 | v3.05,58.42 3.56,58.42 4.02,58.89 DEDO1.6 8.29,58.89 10.29,56.9 15.24,56.9 16.51,55.63 16.51,53.47 20.83,49.15 20.83,48.61 v20.83,48.35 | v48.13,3.43 48.13,3.94 47.79,4.28 DEDO7.6 | v60.45,45.21 57.91,45.21 GBA_CONNECTOR.P$7 54,45.37 v53.85,45.21
  Bottom 0.406: v3.05,7.75 v3.05,17.91 v3.05,27.94 v3.05,38.23 v3.05,48.26 v3.05,58.42 | v20.83,48.35 21.34,48.86 28.5,48.86 42.45,48.86 46.1,45.21 v53.85,45.21 | v60.45,45.21 60.71,45.21 61.85,44.07 61.85,42.55 59.94,40.64 59.94,8.89 57.02,5.97 51.44,5.97 48.9,3.43 v48.13,3.43
FINGER_INT1  (via drill 0.35)
  Top 0.406: v9.27,55.37 9.27,55.5 8.89,55.88 6.44,55.88 6.43,55.89 DEDO1.3 | GBA_CONNECTOR.P$2 54.77,52.87 v54.74,52.83
  Bottom 0.406: v9.27,55.37 9.53,55.12 9.53,50.8 10.64,49.68 18.9,49.68 19.89,50.67 52.58,50.67 v54.74,52.83
FINGER_INT2  (via drill 0.35)
  Top 0.406: v8.51,45.72 v8.5,45.73 DEDO2.3 | 57.84,51.23 GBA_CONNECTOR.P$3 54.83,51.37 v54.69,51.23
  Bottom 0.406: v54.69,51.23 54.06,51.23 52.91,50.08 20.24,50.08 19.18,49.02 11.81,49.02 v8.51,45.72
FINGER_INT3  (via drill 0.35)
  Top 0.406: v8.89,35.56 v8.88,35.57 DEDO3.3 | GBA_CONNECTOR.P$4 54.95,49.87 v54.6,49.52
  Bottom 0.406: v8.89,35.56 8.89,44.96 12.19,48.26 19.43,48.26 20.69,49.52 v54.6,49.52
FINGER_INT4  (via drill 0.35)
  Top 0.406: DEDO4.3 v8.9,25.41 v8.89,25.4 | 57.88,43.69 GBA_CONNECTOR.P$8 54.02,43.87 v53.85,43.69
  Bottom 0.406: v53.85,43.69 52.96,44.58 45.72,44.58 42.06,48.23 21.95,48.23 21.21,47.5 12.38,47.5 9.78,44.9 9.78,35.31 8.89,34.42 v8.89,25.4
FINGER_INT5  (via drill 0.35)
  Top 0.406: GBA_CONNECTOR.P$28 55.01,13.87 v54.86,13.72
  Top 0.508: v8.89,19.81 9.14,19.56 9.14,17.23 7.15,15.24 6.44,15.24 6.43,15.25 DEDO5.3
  Bottom 0.508: v54.86,13.72 54.86,13.34 53.85,12.32 50.93,12.32 40.44,1.83 12.65,1.83 9.91,4.57 9.91,8.64 8.97,9.57 8.97,19.73 v8.89,19.81
FINGER_INT6  (via drill 0.35)
  Top 0.406: GBA_CONNECTOR.P$29 55.04,12.37 v54.86,12.19
  Top 0.508: DEDO6.3 7.37,5.09 8.89,6.6 v8.89,8.13 | 57.88,12.19 GBA_CONNECTOR.P$29
  Bottom 0.508: v8.89,8.13 8.94,8.08 8.94,4.32 12.2,1.07 40.69,1.07 51.18,11.56 54.23,11.56 v54.86,12.19
FINGER_INT7  (via drill 0.35)
  Top 0.406: DEDO7.3 v50.8,6.6 | GBA_CONNECTOR.P$9 60.25,42.37 v60.45,42.16
  Bottom 0.406: v50.8,6.6 56.79,6.6 59.21,9.02 59.21,40.79 59.21,40.92 v60.45,42.16
GND  (via drill 0.3, 0.35, 0.4, 0.61)
  Top 0.254: U1.4 19.9,37.89 19.5,37.89 19.83,38.22 U1.3
  Top 0.35: TB6621FNG.3 20.57,8.62 20.89,8.3 20.57,7.97 TB6621FNG.4 | SERVO6.1 33.97,6.03 TB6621FNG.18 | U3.9 20.55,18.7 20.89,18.36 20.53,18.36 U3.10 | U3.18 29.46,20 29.46,20.32 | U1.18 29.46,35.62 29.46,35.57
  Top 1.016: MOTOR5.1 14.48,13.59 17.53,10.54 17.53,9.27 18.5,8.3 20.89,8.3 | 21.73,4.39 14.79,4.39 MOTOR6.1 | 14.48,23.11 MOTOR4.1 14.48,22.88 14.61,22.74 | 20.89,18.36 19.23,18.36 | MOTOR2.1 14.48,40.89 | 21.29,22.27 19.63,22.27 | 19.5,37.89 21.16,37.89 | 21.59,34 19.25,34 | MOTOR1.1 14.48,50.31 14.61,50.17 | MOTOR3.1 15.62,31.75 15.75,31.75
  Top 1.27: REG_5V.12 REG_5V.21 | REG_3.3V.12 REG_3.3V.21
  Bottom 1.016: MOTOR6.1 15.88,4.7 16,4.57 | MOTOR5.1 14.48,12.45 | 14.22,22.1 14.48,22.35 MOTOR4.1 14.61,23.37 16.76,23.37 | 14.48,31.75 MOTOR3.1 14.61,32.77 16.51,32.77 | 14.48,40.89 MOTOR2.1 14.61,41.91 16.26,41.91 | SERVO4.1 32,20.32 31.75,20.07 | 32.26,13.21 SERVO5.1 SERVO6.1 32.51,6.1 32.26,6.35 | SERVO3.1 34.04,25.91 34.29,25.65 | SERVO3.1 31.75,28.19 | SERVO3.1 34.04,30.48 | 32.51,35.31 SERVO2.1 SERVO1.1 32,42.67 | 15.75,51.31 15.62,51.18 MOTOR1.1 14.1,50.8 13.34,50.8
  other vias: 64.01,1.27 0.64,10.41 0.64,10.92 1.14,20.83 0.64,20.57 1.14,10.67 0.64,21.08 0.64,30.73 0.64,31.24 0.64,41.4 0.64,40.89 1.14,41.15 0.64,51.56 1.14,51.31 0.64,51.05 1.14,30.99 20.07,43.69 24,59.18 24,58.55 24.64,58.55 25.91,58.55 26.54,58.55 26.54,59.18 25.91,59.18 24.64,59.18 25.27,59.18 25.27,58.55 28.32,59.18 28.32,58.55 28.96,58.55 30.23,58.55 30.86,58.55 30.86,59.18 30.23,59.18 28.96,59.18 29.59,59.18 29.59,58.55 42.42,59.18 42.42,58.55 43.05,58.55 44.32,58.55 44.96,58.55 44.96,59.18 44.32,59.18 43.05,59.18 43.69,59.18 43.69,58.55 46.74,59.18 46.74,58.55 47.37,58.55 48.64,58.55 49.28,58.55 49.28,59.18 48.64,59.18 47.37,59.18 48.01,59.18 48.01,58.55 39.88,39.75 39.88,32.38 29.97,6.86 40.51,26.54 65.02,1.27 66.04,1.27 65.02,60.96 66.04,60.96 64.01,60.96
  pour Bottom (isolate 0.012): 0,0 89.92,0 89.92,62.23 0,62.23
  pour Top: 0,0 89.92,0 89.92,62.23 0,62.23
MT1_POT  (via drill 0.35)
  Top 0.406: GBA_CONNECTOR.P$10 55.47,40.87 v55.24,40.64
  Bottom 0.406: v55.24,40.64 55.24,41.91 56.13,42.8 56.13,54.23 54.36,56.01 51.69,56.01 47.62,51.94 19.3,51.94 15.75,55.5 14.99,55.5 MOTOR1.5
MT1A
  Top 0.305: U1.5 20.56,36.92 20.89,36.58 20.58,36.27 U1.6
  Top 1.016: MOTOR1.2 12.57,50.42 17.27,45.72 17.27,39.37 18.21,38.43 18.21,37.08 18.72,36.58 20.89,36.58
MT1B
  Top 0.305: U1.1 20.56,39.18 21.03,39.18 | 21.03,39.18 20.91,39.18 | U1.2 20.72,38.87 21.03,39.18
  Top 1.016: MOTOR1.3 14.87,52.7 15.11,52.7 18.54,49.26 18.54,40.13 19.49,39.18 20.91,39.18
MT2_POT  (via drill 0.35)
  Top 0.406: GBA_CONNECTOR.P$11 55.37,39.37 v55.24,39.24
  Bottom 0.406: MOTOR2.5 15.49,46.86 21.46,46.86 22.17,47.57 41.91,47.57 49.1,40.39 53.09,40.39 54.23,39.24 v55.24,39.24
MT2A
  Top 0.305: U1.11 20.59,33.02 20.93,32.68 20.53,32.68 U1.12
  Top 1.016: MOTOR2.2 12.57,40.64 15.88,37.34 15.88,35.31 18.5,32.68 20.93,32.68
MT2B
  Top 0.305: U1.7 20.54,35.62 20.86,35.29 20.54,34.97 U1.8
  Top 1.016: MOTOR2.3 14.99,43.94 16,42.93 16,38.99 17.04,37.95 17.04,36.2 17.95,35.29 20.86,35.29
MT3_POT  (via drill 0.35)
  Top 0.406: GBA_CONNECTOR.P$12 55.39,37.87 v55.24,37.72
  Bottom 0.406: MOTOR3.5 17.78,36.7 28.07,46.99 41.53,46.99 48.77,39.75 52.58,39.75 54.61,37.72 v55.24,37.72
MT3A
  Top 0.35: U3.6 20.54,20.64 20.85,20.96 20.52,21.3 U3.5
  Top 1.016: MOTOR3.2 12.57,32.13 16.26,28.45 16.26,26.11 17.22,25.14 17.22,22.82 19.09,20.96 20.85,20.96
MT3B
  Top 0.35: U3.1 20.52,23.89 20.86,23.56 20.54,23.56 U3.2
  Top 1.016: MOTOR3.3 14.73,34.8 19.05,30.48 19.05,24.13 19.62,23.56 20.86,23.56
MT4_POT  (via drill 0.35)
  Top 0.406: GBA_CONNECTOR.P$13 55.41,36.37 v55.24,36.2
  Bottom 0.406: MOTOR4.5 21.97,27.3 24.38,29.72 24.38,42.42 28.32,46.35 41.27,46.35 48.51,39.12 52.07,39.12 54.99,36.2 v55.24,36.2
MT4A
  Top 0.35: U3.11 20.55,17.07 20.86,17.07 20.54,16.75 U3.12
  Top 1.016: MOTOR4.2 12.57,22.99 18.49,17.07 20.86,17.07
MT4B
  Top 0.35: U3.8 20.57,19.34 20.89,19.67 20.57,20 U3.7
  Top 1.016: MOTOR4.3 15.24,25.4 16,24.64 16,22.29 18.62,19.67 20.89,19.67
MT5_POT  (via drill 0.35)
  Top 0.406: GBA_CONNECTOR.P$14 55.44,34.87 v55.24,34.67
  Bottom 0.406: MOTOR5.5 14.48,18.8 25.15,29.46 25.15,42.16 28.7,45.72 41.02,45.72 48.26,38.48 51.44,38.48 v55.24,34.67
MT5A
  Top 0.35: TB6621FNG.6 20.54,6.67 20.86,6.99 20.52,7.33 TB6621FNG.5
  Top 1.016: MOTOR5.2 12.57,13.53 16.13,9.97 16.13,8 17.14,6.99 20.86,6.99
MT5B
  Top 0.35: TB6621FNG.2 20.55,9.28 20.87,9.6 20.55,9.93 TB6621FNG.1
  Top 1.016: 20.87,9.6 19.61,9.6 18.8,10.41 18.8,11.94 14.73,16 MOTOR5.3
MT6_POT  (via drill 0.35)
  Top 0.406: GBA_CONNECTOR.P$15 55.41,33.37 v55.24,33.53
  Bottom 0.406: MOTOR6.5 16.76,10.79 16.76,19.94 25.91,29.08 25.91,42.04 29.01,45.14 40.64,45.14 48.06,37.72 51.05,37.72 v55.24,33.53
MT6A
  Top 0.35: TB6621FNG.12 20.53,3.09 20.83,3.09 20.56,3.09 TB6621FNG.11
  Top 1.016: MOTOR6.2 12.57,3.94 13.46,3.05 18.29,3.05 18.33,3.09 20.83,3.09
MT6B
  Top 0.35: TB6621FNG.7 20.54,6.03 20.88,5.69 20.56,5.38 TB6621FNG.8
  Top 1.016: MOTOR6.3 14.94,6.6 15.85,5.69 20.88,5.69
N$1
  Bottom 0.406: T1.3 41.53,56.49 R8.1
  Bottom 0.508: 84.06,57.14 SW1.B 84.06,55.99 83.44,55.37 68.45,55.37 64.26,59.56 52.04,59.56 47.34,54.86 R8.1
N$2
  Top 0.35: REG_5V.17 REG_5V.16
N$3
  Top 0.406: R12.2 40.77,53.47 40.77,54.61 41.36,55.2 REG_3.3V.24
N$4
  Top 0.35: REG_3.3V.17 REG_3.3V.16
N$6
  Top 0.406: REG_5V.24 23.07,55.2 22.35,54.48 22.35,53.21 R3.2
PWM_MT1A
  Top 0.35: U1.21 31.67,37.57 33.09,38.99 40.89,38.99 42.04,37.85 42.04,34.54 46.22,30.36 GBA_CONNECTOR.P$17
PWM_MT1B_SERVO1
  Top 0.35: U1.22 31.47,38.22 32.83,39.57 38.56,39.57 39.12,40.13 SERVO1.3 39.12,41.78 39.94,40.96 42.67,38.23 42.67,34.8 46.49,30.98 54.83,30.98 55.72,31.86 GBA_CONNECTOR.P$16
PWM_MT2A_SERVO2
  Top 0.35: 39.12,34.8 SERVO2.3 | SERVO2.3 39.12,33.02 38.1,32 34.16,32 31.2,34.97 U1.17 | SERVO2.3 39.12,34.29 41.97,31.43 | 41.97,31.43 42.67,30.73 | GBA_CONNECTOR.P$18 44.54,28.86 41.97,31.43
PWM_MT2B
  Top 0.35: U1.16 30.96,34.32 33.78,31.5 41.15,31.5 44.32,28.32 54.74,28.32 55.69,27.36 GBA_CONNECTOR.P$19
PWM_MT3A
  Top 0.35: U3.21 30.2,21.95 33.27,25.02 54.74,25.02 55.39,24.36 GBA_CONNECTOR.P$21
PWM_MT3B_SERVO3
  Top 0.35: U3.22 29.95,22.59 33,25.65 38.1,25.65 39.12,26.67 SERVO3.3 40.39,28.19 42.61,25.97 42.72,25.86 GBA_CONNECTOR.P$20
PWM_MT4A_SERVO4
  Top 0.35: U3.17 29.93,19.34 31.75,17.53 38.1,17.53 39.12,18.54 SERVO4.3 40.89,20.32 42.55,21.98 54.83,21.98 55.72,22.86 GBA_CONNECTOR.P$22
PWM_MT4B
  Top 0.35: U3.16 29.69,18.7 31.5,16.89 38.35,16.89 42.83,21.36 GBA_CONNECTOR.P$23
PWM_MT5A
  Top 0.35: TB6621FNG.21 29.44,7.97 31.29,9.82 38.23,9.82 46.77,18.36 GBA_CONNECTOR.P$25
PWM_MT5B_SERVO5
  Top 0.35: TB6621FNG.22 29.22,8.62 31,10.41 31.24,10.41 37.59,10.41 39.12,11.94 SERVO5.3 40.77,13.21 46.53,18.98 54.83,18.98 55.72,19.86 GBA_CONNECTOR.P$24
PWM_MT6A_SERVO6
  Top 0.35: SERVO6.3 39.12,6.6 | SERVO6.3 39.12,4.32 38.35,3.56 31.88,3.56 30.06,5.38 TB6621FNG.17 | SERVO6.3 39.12,6.86 48.23,15.98 54.83,15.98 55.72,16.86 GBA_CONNECTOR.P$26
PWM_MT6B
  Top 0.35: TB6621FNG.16 29.95,4.72 31.62,3.05 38.99,3.05 40.39,4.45 40.39,7.37 48.38,15.37 GBA_CONNECTOR.P$27
SCL  (via drill 0.35, 0.4)
  Top 0.508: DEDO6.4 6.87,6.09 v6.9,6.05 | DEDO5.4 v6.86,16.26 | DEDO4.4 6.78,26.41 v6.81,26.37 | DEDO3.4 6.85,36.57 v6.86,36.58 | DEDO2.4 6.84,46.73 v6.86,46.71 | DEDO1.4 6.85,56.89 | 6.85,56.89 8.5,56.89 8.75,56.64 v8.76,56.64 | 6.85,56.89 v6.86,56.9 | v6.86,1.78 6.86,1.27 7.57,0.56 40.31,0.56 49.32,9.57 52.03,9.57 R5.2 | DEDO7.4 49.79,7.25 R5.2 | GBA_CONNECTOR.P$31 52.23,9.37 R5.2
  Bottom 0.35: INA219.5 15.97,56.68 8.8,56.68 v8.76,56.64
  Bottom 0.508: v6.86,1.78 6.9,1.82 v6.9,6.05 | v6.91,6.06 v6.9,6.05 | v6.9,6.05 6.86,6.1 v6.86,16.26 6.91,16.2 6.81,16.3 v6.81,26.37 6.81,36.53 v6.86,36.58 v6.86,46.71 v6.86,56.9
SDA  (via drill 0.35, 0.4)
  Top 0.406: DEDO7.5 48.79,6.58 v48.77,6.6
  Top 0.508: DEDO6.5 7.85,7.09 v7.87,7.11 | v8.18,1.78 8.18,1.73 8.64,1.27 39.88,1.27 49.29,10.69 49.31,10.67 R4.2 50.55,10.54 54.61,10.54 v54.86,10.79 54.93,10.87 GBA_CONNECTOR.P$30 57.83,10.92 | v7.92,17.19 7.86,17.25 DEDO5.5 | DEDO4.5 7.72,27.41 v7.75,27.43 | v7.79,37.64 7.72,37.57 7.3,37.57 DEDO3.5 | DEDO2.5 7.72,47.73 v7.75,47.75 | DEDO1.5 7.9,57.89 v8.13,57.66
  Bottom 0.35: INA219.6 18.51,57.33 18.39,57.21 9.21,57.21 8.76,57.66 v8.13,57.66
  Bottom 0.508: v8.18,1.78 7.92,2.03 7.92,7.06 v7.87,7.11 7.87,15.49 7.87,17.14 v7.92,17.19 7.7,17.19 7.7,27.48 v7.75,27.43 7.75,37 7.75,37.59 v7.79,37.64 7.75,37.68 v7.75,47.75 7.75,56.77 8.13,57.15 v8.13,57.66 | v48.77,6.6 48.77,8.13 51.44,10.79 v54.86,10.79
SOK
  Top 0.406: GBA_CONNECTOR.P$5 59.62,48.19 60.45,49.02 60.45,54.86 59.94,55.37 56.26,55.37 R6.2 R7.1
SS/TR_3.3V
  Top 0.406: REG_3.3V.6 46.82,52.49 47.37,51.94 R14.2
  Top 0.508: R14.2 R13.1
TT_3.3V
  Top 0.406: R17.2 45.85,52.07 46.17,52.4 REG_3.3V.5
TT_5V
  Top 0.406: REG_5V.5 27.76,50.86 R9.2
VBAT
  Bottom 0.35: INA219.2 22.66,57.98 23.75,56.9 INA_BYPASS.1
  Bottom 0.406: T1.2 39.57,54.94 R8.2
  Bottom 1.27: INA_BYPASS.1 32.64,55.5 33.27,54.86 R20.1 | R20.1 | R8.2 R20.1
VIN  (via drill 0.3, 0.6)
  Top 0.406: R18.2 v53.34,61.21
  Top 0.813: 25.26,57.15 REG_5V.22 | R10.2 35.66,56.79 C2.+
  Top 1.016: v35.81,57.66 R10.2
  Top 1.27: C4.+ 21.42,57.13 REG_5V.22 REG_5V.11 33.45,57.13 C2.+
  Bottom 0.406: v53.34,61.21 41.4,61.21 40.54,60.35 T1.1
  Bottom 1.016: T1.1 40.28,58.29 36.45,58.29 v35.81,57.66
VLIPO
  Bottom 0.35: INA219.1 22.72,58.63 23.88,57.47 30.93,57.47 31.88,58.42 INA_BYPASS.2
  Bottom 1.27: BATTERY.3 16.77,60.46 23.24,60.46 32.77,60.46 | 32.77,60.46 R20.2 | INA_BYPASS.2 32.64,60.33 32.77,60.46

### Text on the board
Top: Insert SoK here
Bottom: Team Magma / Tech. Lab. | ExSoKskeletal / Mitt
tPlace: 7-12V | + | - | ON | OFF | NeKuNeKo / Inc. | - | + | S | - | + | S | - | + | S | - | + | S | - | + | S | - | + | S | SoK Compatible / Host Device
bPlace: + | - | 7-12V | ON | OFF | Rev. 1.1 / May. 2019
tNames: TB6621FNG | TB6621FNG | TB6621FNG
tStop: Insert SoK here
bStop: Team Magma / Tech. Lab. | ExSoKskeletal / Mitt